# Altium schematic sheet OPENMV_MT9V034.SchDoc
size A4
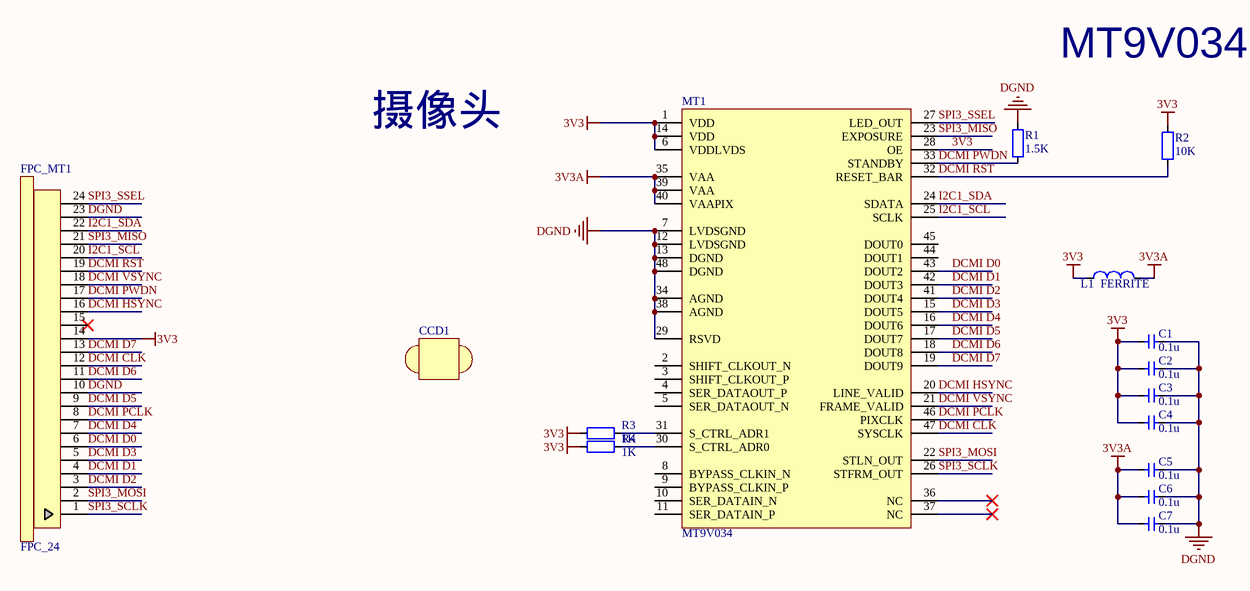
[diagram p0: OPENMV_MT9V034.SchDoc]

## Parts
C1  value 0.1u  [LC-0603_C]  (hidden comment: 104)
C2  value 0.1u  [LC-0603_C]  (hidden comment: 10uF)
C3  value 0.1u  [LC-0603_C]  (hidden comment: 104)
C4  value 0.1u  [LC-0603_C]  (hidden comment: 104)
C5  value 0.1u  [LC-0603_C]  (hidden comment: 104)
C6  value 0.1u  [LC-0603_C]  (hidden comment: 10uF)
C7  value 0.1u  [LC-0603_C]  (hidden comment: 104)
CCD1  CCD  [CCD_LENS_20MM]  (value not drawn)
FPC_MT1  FPC_24  [FPC_24]
L1  value FERRITE  [LC-0603_L]  (hidden comment: 180nH)
MT1  MT9V034  [CLCC-48]
R1  value 1.5K  [LC-0603_R]  (hidden comment: 4.7K)
R2  10K  [LC-0603_R]
R3  1K  [LC-0603_R]
R4  1K  [LC-0603_R]

## Nets
3V3: C1.2 C2.2 C3.2 C4.2 FPC_MT1.14 L1.1 MT1.1(VDD) MT1.6(VDDLVDS) MT1.14(VDD) MT1.28(OE) R2.2 R3.2 R4.2
3V3A: C5.2 C6.2 C7.2 L1.2 MT1.35(VAA) MT1.39(VAA) MT1.40(VAAPIX)
DGND: C1.1 C2.1 C3.1 C4.1 C5.1 C6.1 C7.1 FPC_MT1.10 FPC_MT1.23 MT1.7(LVDSGND) MT1.12(LVDSGND) MT1.13(DGND) MT1.29(RSVD) MT1.34(AGND) MT1.38(AGND) MT1.48(DGND) R1.2
DCMI CLK: FPC_MT1.12 MT1.47(SYSCLK)
DCMI D0: FPC_MT1.6 MT1.43(DOUT2)
DCMI D1: FPC_MT1.4 MT1.42(DOUT3)
DCMI D2: FPC_MT1.3 MT1.41(DOUT4)
DCMI D3: FPC_MT1.5 MT1.15(DOUT5)
DCMI D4: FPC_MT1.7 MT1.16(DOUT6)
DCMI D5: FPC_MT1.9 MT1.17(DOUT7)
DCMI D6: FPC_MT1.11 MT1.18(DOUT8)
DCMI D7: FPC_MT1.13 MT1.19(DOUT9)
DCMI HSYNC: FPC_MT1.16 MT1.20(LINE_VALID)
DCMI PCLK: FPC_MT1.8 MT1.46(PIXCLK)
DCMI PWDN: FPC_MT1.17 MT1.33(STANDBY) R1.1
DCMI RST: FPC_MT1.19 MT1.32(RESET_BAR) R2.1
DCMI VSYNC: FPC_MT1.18 MT1.21(FRAME_VALID)
I2C1_SCL: FPC_MT1.20 MT1.25(SCLK)
I2C1_SDA: FPC_MT1.22 MT1.24(SDATA)
SPI3_MISO: FPC_MT1.21 MT1.23(EXPOSURE)
SPI3_MOSI: FPC_MT1.2 MT1.22(STLN_OUT)
SPI3_SCLK: FPC_MT1.1 MT1.26(STFRM_OUT)
SPI3_SSEL: FPC_MT1.24 MT1.27(LED_OUT)
NetMT1_30: MT1.30(S_CTRL_ADR0) R4.1
NetMT1_31: MT1.31(S_CTRL_ADR1) R3.1

Not connected (* = marked no-connect by the designer): FPC_MT1 15*; MT1 2(SHIFT_CLKOUT_N) 3(SHIFT_CLKOUT_P) 4(SER_DATAOUT_P) 5(SER_DATAOUT_N) 8(BYPASS_CLKIN_N) 9(BYPASS_CLKIN_P) 10(SER_DATAIN_N) 11(SER_DATAIN_P) 36(NC)* 37(NC)* 44(DOUT1) 45(DOUT0)

## Notes on the sheet
- MT9V034
- 摄像头

## Library data of the parts
C1 C3-C7 = Cap_0603: Capacitor
C2 = Cap_0402: Capacitor
CCD1 = lensCCD_20
L1 = Ind_0603: Inductor
MT1 = MT9V034: CMOS
R1-R4 = Res_0603: Resistor
  R2: Value: 10K
  R3 R4: Value: 1K